# EAGLE design LED-Gauge-Panel (EAGLE 6.5.0)
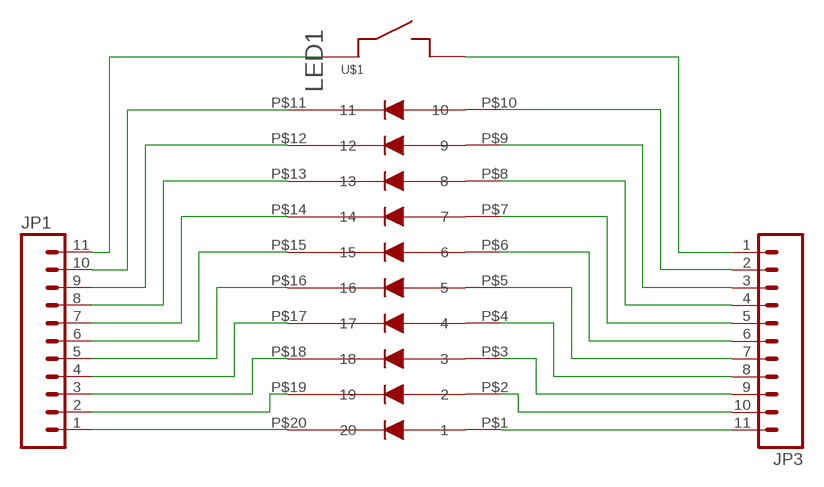
[diagram p0: schematic, sheet 1]

## Parts
JP1  M11PTH  [1X11]
JP3  M11PTH  [1X11]
LED1  LED-DC7G3HWA  [LED-10]
U$1  MOMENTARY-SWITCH-EVQ1  [EVQ11]

## Nets
N$1: JP1.1 LED1.P$20
N$2: JP1.2 LED1.P$19
N$3: JP1.3 LED1.P$18
N$4: JP1.4 LED1.P$17
N$5: JP1.5 LED1.P$16
N$6: JP1.6 LED1.P$15
N$7: JP1.7 LED1.P$14
N$8: JP1.8 LED1.P$13
N$9: JP1.9 LED1.P$12
N$10: JP1.10 LED1.P$11
N$11: JP3.11 LED1.P$1
N$12: JP3.10 LED1.P$2
N$13: JP3.9 LED1.P$3
N$14: JP3.8 LED1.P$4
N$15: JP3.7 LED1.P$5
N$16: JP3.6 LED1.P$6
N$17: JP3.5 LED1.P$7
N$18: JP3.4 LED1.P$8
N$19: JP3.3 LED1.P$9
N$20: JP3.2 LED1.P$10
N$21: JP1.11 U$1.P$1
N$22: JP3.1 U$1.P$2

## Library data of the parts
JP1 JP3 = SparkFun-Connectors:M11: Header 11 Standard 11-pin 0.1" header. Use with straight break away headers (SKU : PRT-00116), right angle break away headers (PRT-00553), swiss pins (PRT-00743), machine pins (PRT-00117), and female headers (PRT-00115).
LED1 = 2016PowerPackLibraries:LED-DC7G3HWA: 10 segement LED - Kingbright part # DC7G3HWA
U$1 = 2016PowerPackLibraries:MOMENTARY-SWITCH-EVQ1

## Board
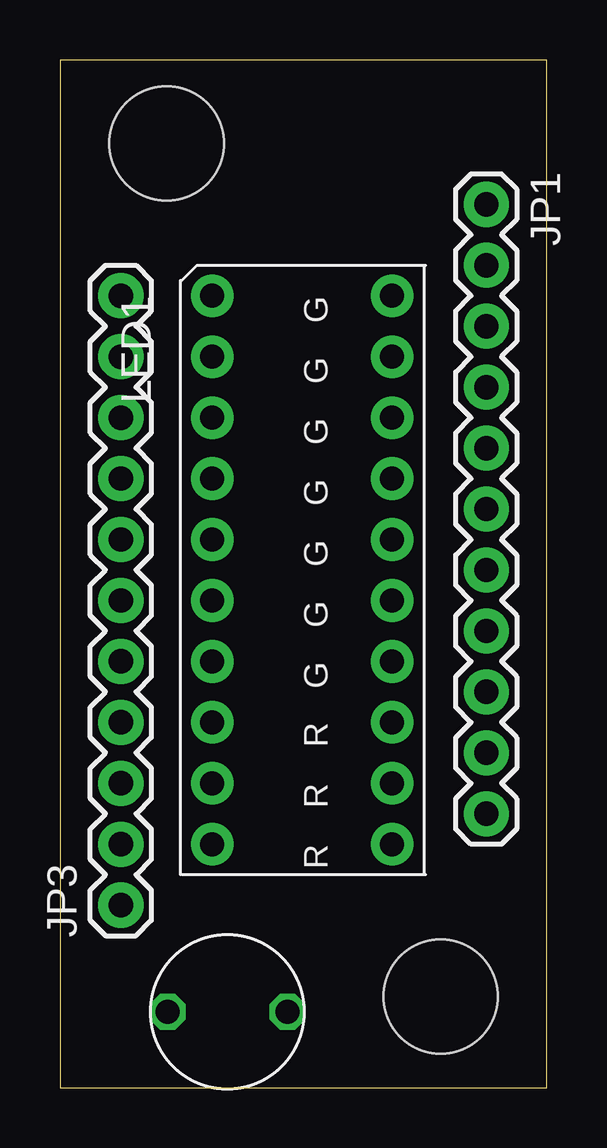
[diagram p1: board, top side]
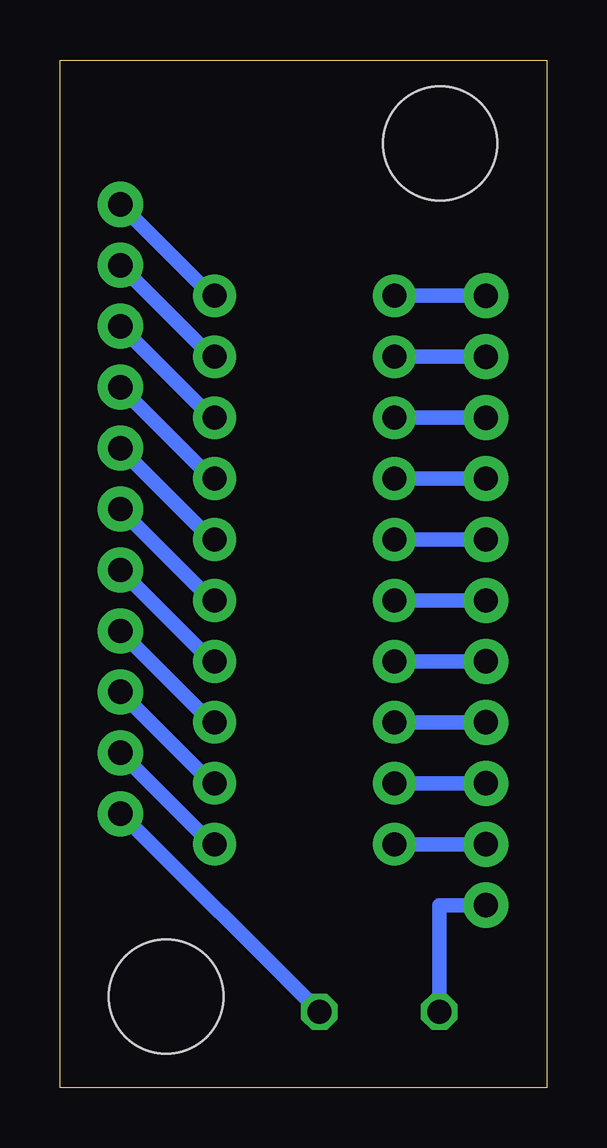
[diagram p2: board, bottom side, seen from below]

Size 20.3 x 42.85 mm. Coordinates in mm from the lower left corner, seen from the top.
Outline: 0,0 20.3,0 20.3,42.85 0,42.85 0,0
Copper layers (1*16): Top 0.035mm / dielectric 1.5mm / Bottom 0.035mm
Design rules "default": minimum track width 10mil, minimum drill 24mil, track to track 8mil, track to pad 8mil, pad to pad 8mil, via to via 8mil, smd to smd 8mil, copper to edge 40mil, drill to drill 8mil, minimum pad ring 10mil, minimum via ring 8mil, stop-mask expansion 4mil, vias tented up to drill 0mil, thermal gap 10mil
Holes 4.76 mm at 15.88,3.81 4.45,39.37

### Footprints (pad centres in the part's own frame; a part is rotated, then mirrored left to right if it is on the bottom)
1X11 = drill 1.016 pad 1.88: 1 0,0; 2 2.54,0; 3 5.08,0; 4 7.62,0; 5 10.16,0; 6 12.7,0; 7 15.24,0; 8 17.78,0; 9 20.32,0; 10 22.86,0; 11 25.4,0
LED-10 = drill 1 pad 1.778: P$1 0,0; P$2 2.54,0; P$3 5.08,0; P$4 7.62,0; P$5 10.16,0; P$6 12.7,0; P$7 15.24,0; P$8 17.78,0; P$9 20.32,0; P$10 22.86,0; P$11 22.86,7.5; P$12 20.32,7.5; P$13 17.78,7.5; P$14 15.24,7.5; P$15 12.7,7.5; P$16 10.16,7.5; P$17 7.62,7.5; P$18 5.08,7.5; P$19 2.54,7.5; P$20 0,7.5
EVQ11 = drill 1 octagon: P$1 0,2.5; P$2 0,-2.5

### Placement (x,y rotation side)
JP1  17.78,36.83 270 top
JP3  2.54,7.62 90 top
LED1  6.35,33.02 270 top
U$1  6.99,3.17 270 top

### Tracks (layer width: path | path; a pad name or v marks a point on that pad's centre or on a via)
N$1
  Bottom 0.61: LED1.P$20 13.97,33.02 JP1.1
N$2
  Bottom 0.61: LED1.P$19 13.97,30.48 JP1.2
N$3
  Bottom 0.61: LED1.P$18 13.97,27.94 JP1.3
N$4
  Bottom 0.61: LED1.P$17 13.97,25.4 JP1.4
N$5
  Bottom 0.61: LED1.P$16 13.97,22.86 JP1.5
N$6
  Bottom 0.61: LED1.P$15 13.97,20.32 JP1.6
N$7
  Bottom 0.61: LED1.P$14 13.97,17.78 JP1.7
N$8
  Bottom 0.61: LED1.P$13 13.97,15.24 JP1.8
N$9
  Bottom 0.61: LED1.P$12 13.97,12.7 JP1.9
N$10
  Bottom 0.61: LED1.P$11 13.97,10.16 JP1.10
N$11
  Bottom 0.61: LED1.P$1 JP3.11
N$12
  Bottom 0.61: LED1.P$2 JP3.10
N$13
  Bottom 0.61: LED1.P$3 JP3.9
N$14
  Bottom 0.61: LED1.P$4 JP3.8
N$15
  Bottom 0.61: JP3.7 LED1.P$5
N$16
  Bottom 0.61: JP3.6 LED1.P$6
N$17
  Bottom 0.61: JP3.5 LED1.P$7
N$18
  Bottom 0.61: JP3.4 LED1.P$8
N$19
  Bottom 0.61: JP3.3 LED1.P$9
N$20
  Bottom 0.61: JP3.2 LED1.P$10
N$21
  Bottom 0.61: JP1.11 17.74,11.43 U$1.P$1
N$22
  Bottom 0.61: JP3.1 4.49,7.62 U$1.P$2